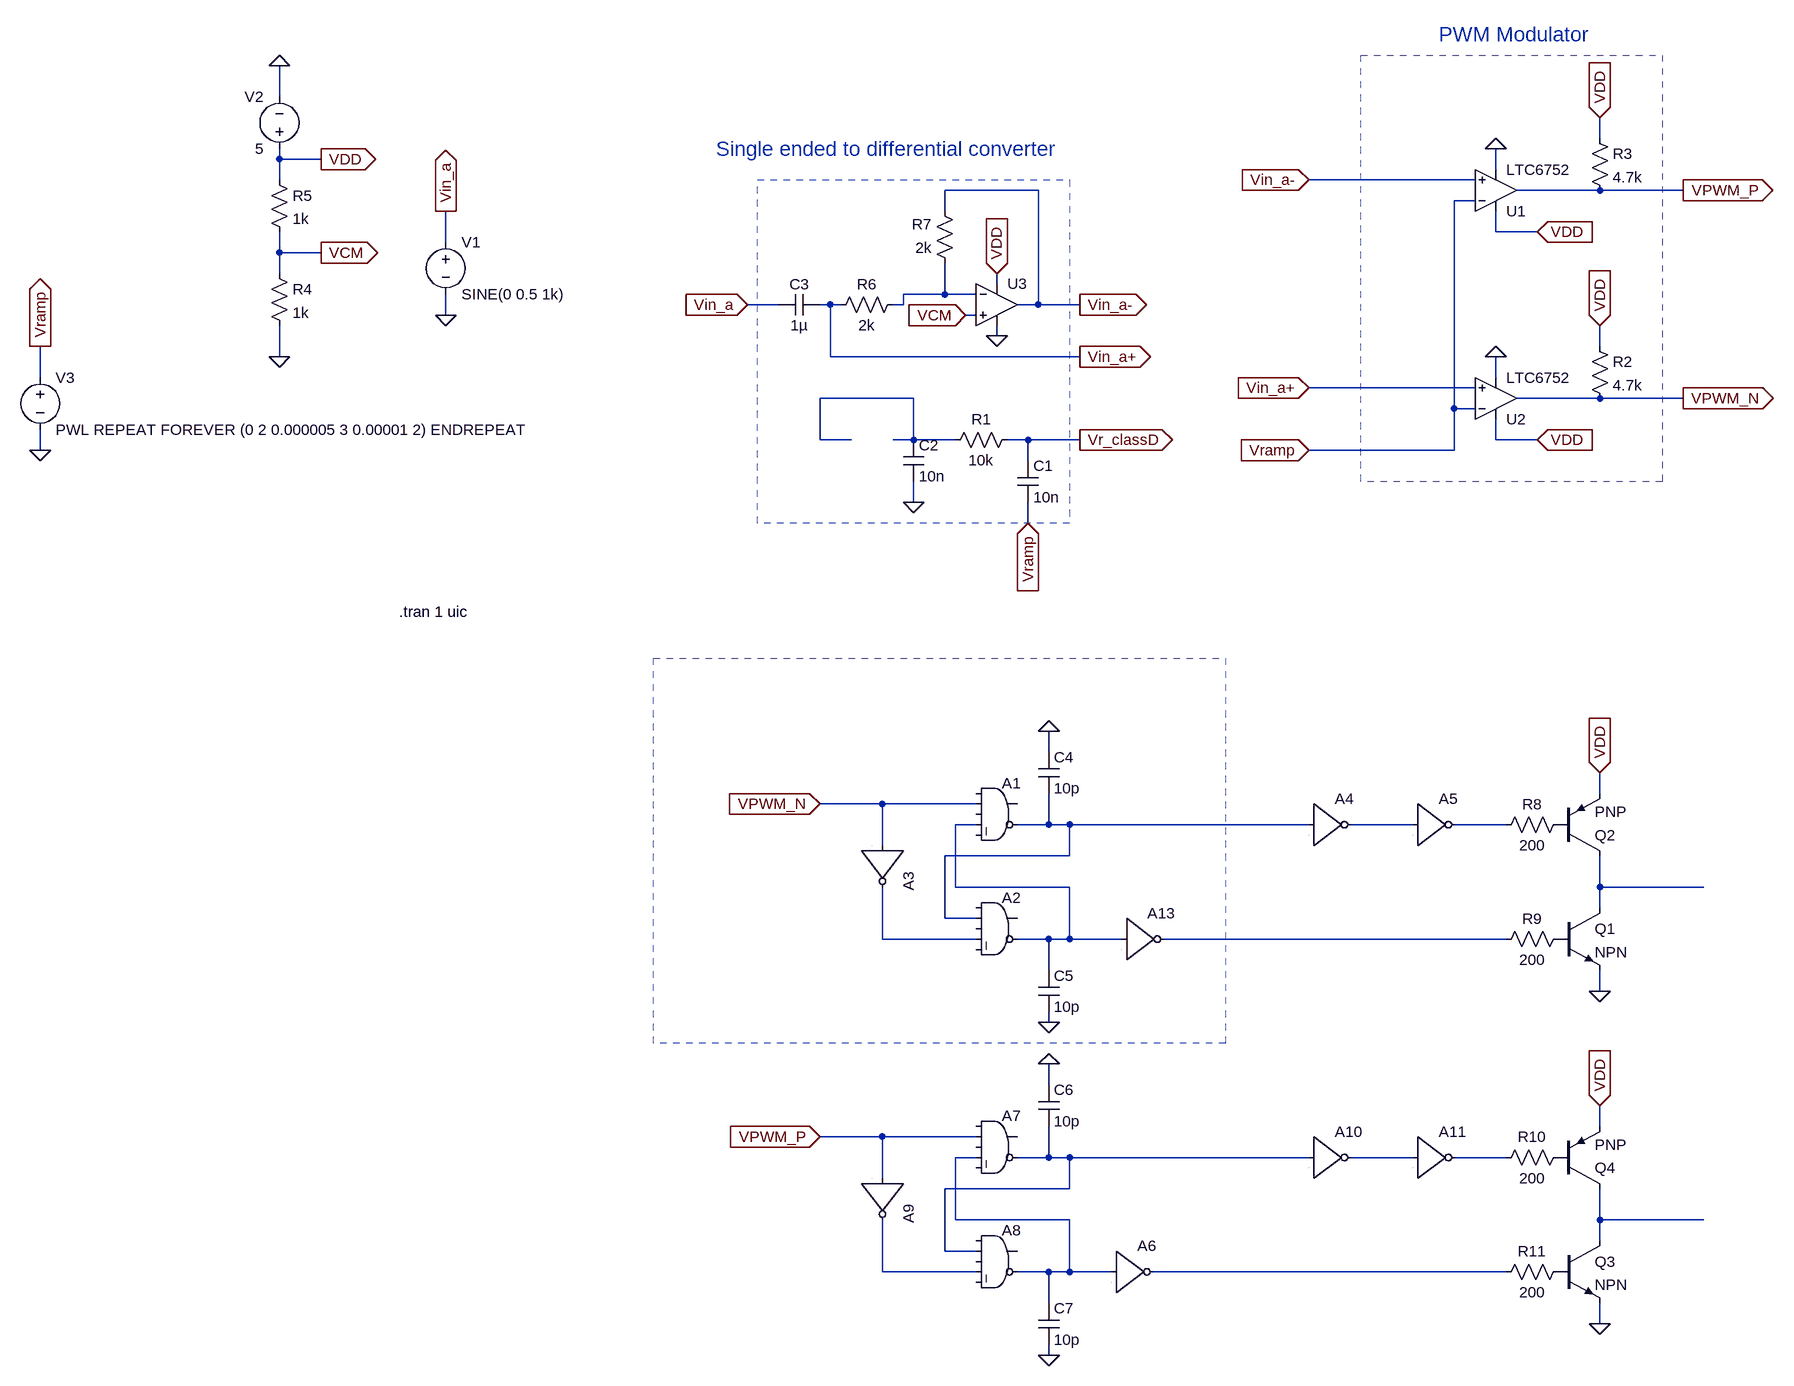
[diagram p0: schematic prelab5.asc]
prelab5.asc, the LTspice schematic file:
Version 4
SHEET 1 1432 1684
WIRE -896 -272 -896 -320
WIRE 1136 -208 1136 -240
WIRE -896 -176 -896 -192
WIRE -832 -176 -896 -176
WIRE 976 -160 976 -192
WIRE -896 -144 -896 -176
WIRE 944 -144 688 -144
WIRE 272 -128 128 -128
WIRE 1136 -128 1008 -128
WIRE 1264 -128 1136 -128
WIRE 944 -112 912 -112
WIRE 128 -96 128 -128
WIRE 976 -64 976 -96
WIRE 1040 -64 976 -64
WIRE -640 -48 -640 -96
WIRE -896 -32 -896 -64
WIRE -832 -32 -896 -32
WIRE -896 0 -896 -32
WIRE 208 16 208 0
WIRE 128 32 128 -16
WIRE 128 32 64 32
WIRE 176 32 128 32
WIRE -128 48 -176 48
WIRE -48 48 -64 48
WIRE -32 48 -48 48
WIRE 64 48 64 32
WIRE 64 48 48 48
WIRE 272 48 272 -128
WIRE 272 48 240 48
WIRE 336 48 272 48
WIRE -640 64 -640 32
WIRE 176 64 160 64
WIRE 208 96 208 80
WIRE 1136 112 1136 80
WIRE -896 128 -896 80
WIRE -48 128 -48 48
WIRE 336 128 -48 128
WIRE -1264 160 -1264 112
WIRE 976 160 976 128
WIRE 944 176 688 176
WIRE 80 192 -64 192
WIRE 1136 192 1008 192
WIRE 1264 192 1136 192
WIRE 912 208 912 -112
WIRE 944 208 912 208
WIRE -64 256 -64 192
WIRE -16 256 -64 256
WIRE 80 256 80 192
WIRE 80 256 48 256
WIRE 144 256 80 256
WIRE 256 256 224 256
WIRE 336 256 256 256
WIRE 976 256 976 224
WIRE 1040 256 976 256
WIRE -1264 272 -1264 240
WIRE 912 272 912 208
WIRE 912 272 688 272
WIRE 256 288 256 256
WIRE 80 352 80 320
WIRE 256 384 256 352
WIRE 288 736 288 704
WIRE 1136 800 1136 768
WIRE 32 816 -64 816
WIRE 176 816 32 816
WIRE 176 848 144 848
WIRE 288 848 288 800
WIRE 288 848 240 848
WIRE 320 848 288 848
WIRE 688 848 320 848
WIRE 848 848 752 848
WIRE 992 848 912 848
WIRE 32 880 32 816
WIRE 320 896 320 848
WIRE 320 896 128 896
WIRE 144 944 144 848
WIRE 320 944 144 944
WIRE 1136 944 1136 896
WIRE 1296 944 1136 944
WIRE 1136 976 1136 944
WIRE 128 992 128 896
WIRE 176 992 128 992
WIRE 32 1024 32 944
WIRE 176 1024 32 1024
WIRE 288 1024 240 1024
WIRE 320 1024 320 944
WIRE 320 1024 288 1024
WIRE 400 1024 320 1024
WIRE 992 1024 464 1024
WIRE 288 1072 288 1024
WIRE 1136 1104 1136 1072
WIRE 288 1152 288 1136
WIRE 288 1248 288 1216
WIRE 1136 1312 1136 1280
WIRE 32 1328 -64 1328
WIRE 176 1328 32 1328
WIRE 176 1360 144 1360
WIRE 288 1360 288 1312
WIRE 288 1360 240 1360
WIRE 320 1360 288 1360
WIRE 688 1360 320 1360
WIRE 848 1360 752 1360
WIRE 992 1360 912 1360
WIRE 32 1392 32 1328
WIRE 320 1408 320 1360
WIRE 320 1408 128 1408
WIRE 144 1456 144 1360
WIRE 320 1456 144 1456
WIRE 1136 1456 1136 1408
WIRE 1296 1456 1136 1456
WIRE 1136 1488 1136 1456
WIRE 128 1504 128 1408
WIRE 176 1504 128 1504
WIRE 32 1536 32 1456
WIRE 176 1536 32 1536
WIRE 288 1536 240 1536
WIRE 320 1536 320 1456
WIRE 320 1536 288 1536
WIRE 384 1536 320 1536
WIRE 992 1536 448 1536
WIRE 288 1584 288 1536
WIRE 1136 1616 1136 1584
WIRE 288 1664 288 1648
FLAG 336 48 Vin_a-
IOPIN 336 48 Out
FLAG 336 256 Vr_classD
IOPIN 336 256 Out
FLAG -176 48 Vin_a
IOPIN -176 48 In
FLAG 256 384 Vramp
IOPIN 256 384 In
FLAG -640 64 0
FLAG -640 -96 Vin_a
IOPIN -640 -96 Out
FLAG 1040 -64 VDD
IOPIN 1040 -64 In
FLAG 1040 256 VDD
IOPIN 1040 256 In
FLAG 976 128 0
FLAG 976 -192 0
FLAG 1136 -240 VDD
IOPIN 1136 -240 In
FLAG 1136 80 VDD
IOPIN 1136 80 In
FLAG 688 -144 Vin_a-
IOPIN 688 -144 In
FLAG 688 176 Vin_a+
IOPIN 688 176 In
FLAG 688 272 Vramp
IOPIN 688 272 In
FLAG 1264 -128 VPWM_P
IOPIN 1264 -128 Out
FLAG 1264 192 VPWM_N
IOPIN 1264 192 Out
FLAG -896 128 0
FLAG -896 -320 0
FLAG -832 -176 VDD
IOPIN -832 -176 Out
FLAG -832 -32 VCM
IOPIN -832 -32 Out
FLAG 208 0 VDD
IOPIN 208 0 In
FLAG 208 96 0
FLAG 160 64 VCM
IOPIN 160 64 In
FLAG -1264 112 Vramp
IOPIN -1264 112 Out
FLAG -1264 272 0
FLAG 80 352 0
FLAG 336 128 Vin_a+
IOPIN 336 128 Out
FLAG 288 1152 0
FLAG 288 704 0
FLAG -64 816 VPWM_N
IOPIN -64 816 In
FLAG 288 1664 0
FLAG 288 1216 0
FLAG -64 1328 VPWM_P
IOPIN -64 1328 In
FLAG 1136 1280 VDD
IOPIN 1136 1280 In
FLAG 1136 768 VDD
IOPIN 1136 768 In
FLAG 1136 1104 0
FLAG 1136 1616 0
SYMBOL res 240 240 R90
WINDOW 0 0 56 VBottom 2
WINDOW 3 32 56 VTop 2
SYMATTR InstName R1
SYMATTR Value 10k
SYMBOL cap 240 288 R0
SYMATTR InstName C1
SYMATTR Value 10n
SYMBOL cap 64 256 R0
SYMATTR InstName C2
SYMATTR Value 10n
SYMBOL voltage -640 -64 R0
WINDOW 123 0 0 Left 0
WINDOW 39 0 0 Left 0
SYMATTR InstName V1
SYMATTR Value SINE(0 0.5 1k)
SYMBOL Comparators\\LTC6752 976 -64 M180
SYMATTR InstName U1
SYMBOL Comparators\\LTC6752 976 256 M180
SYMATTR InstName U2
SYMBOL res 1120 96 R0
SYMATTR InstName R2
SYMATTR Value 4.7k
SYMBOL res 1120 -224 R0
SYMATTR InstName R3
SYMATTR Value 4.7k
SYMBOL res -912 -16 R0
SYMATTR InstName R4
SYMATTR Value 1k
SYMBOL res -912 -160 R0
SYMATTR InstName R5
SYMATTR Value 1k
SYMBOL voltage -896 -176 R180
WINDOW 0 24 96 Left 2
WINDOW 3 24 16 Left 2
WINDOW 123 0 0 Left 0
WINDOW 39 0 0 Left 0
SYMATTR InstName V2
SYMATTR Value 5
SYMBOL res 64 32 R90
WINDOW 0 0 56 VBottom 2
WINDOW 3 32 56 VTop 2
SYMATTR InstName R6
SYMATTR Value 2k
SYMBOL res 144 0 R180
WINDOW 0 36 76 Left 2
WINDOW 3 36 40 Left 2
SYMATTR InstName R7
SYMATTR Value 2k
SYMBOL cap -64 32 R90
WINDOW 0 0 32 VBottom 2
WINDOW 3 32 32 VTop 2
SYMATTR InstName C3
SYMATTR Value 1µ
SYMBOL OpAmps\\UniversalOpAmp1 208 48 R0
SYMATTR InstName U3
SYMBOL voltage -1264 144 R0
SYMATTR InstName V3
SYMATTR Value PWL REPEAT FOREVER (0 2 0.000005 3 0.00001 2) ENDREPEAT
SYMBOL Digital\\and 208 768 R0
SYMATTR InstName A1
SYMATTR SpiceLine Vhigh=5 Vlow=0 ref=2.5
SYMBOL Digital\\and 208 944 R0
SYMATTR InstName A2
SYMATTR SpiceLine Vhigh=5 Vlow=0 ref=2.5
SYMBOL Digital\\inv 96 880 R90
SYMATTR InstName A3
SYMATTR SpiceLine Vhigh=5 Vlow=0 ref=2.5
SYMBOL cap 272 736 R0
SYMATTR InstName C4
SYMATTR Value 10p
SYMBOL cap 272 1072 R0
SYMATTR InstName C5
SYMATTR Value 10p
SYMBOL Digital\\inv 688 784 R0
SYMATTR InstName A4
SYMATTR SpiceLine Vhigh=5 Vlow=0 ref=2.5
SYMBOL Digital\\inv 848 784 R0
SYMATTR InstName A5
SYMATTR SpiceLine Vhigh=5 Vlow=0 ref=2.5
SYMBOL res 1088 832 R90
WINDOW 0 0 56 VBottom 2
WINDOW 3 32 56 VTop 2
SYMATTR InstName R8
SYMATTR Value 200
SYMBOL res 1088 1008 R90
WINDOW 0 0 56 VBottom 2
WINDOW 3 32 56 VTop 2
SYMATTR InstName R9
SYMATTR Value 200
SYMBOL npn 1072 976 R0
SYMATTR InstName Q1
SYMBOL pnp 1072 896 M180
SYMATTR InstName Q2
SYMBOL Digital\\and 208 1280 R0
SYMATTR InstName A7
SYMATTR SpiceLine Vhigh=5 Vlow=0 ref=2.5
SYMBOL Digital\\and 208 1456 R0
SYMATTR InstName A8
SYMATTR SpiceLine Vhigh=5 Vlow=0 ref=2.5
SYMBOL Digital\\inv 96 1392 R90
SYMATTR InstName A9
SYMATTR SpiceLine Vhigh=5 Vlow=0 ref=2.5
SYMBOL cap 272 1248 R0
SYMATTR InstName C6
SYMATTR Value 10p
SYMBOL cap 272 1584 R0
SYMATTR InstName C7
SYMATTR Value 10p
SYMBOL Digital\\inv 688 1296 R0
SYMATTR InstName A10
SYMATTR SpiceLine Vhigh=5 Vlow=0 ref=2.5
SYMBOL Digital\\inv 848 1296 R0
SYMATTR InstName A11
SYMATTR SpiceLine Vhigh=5 Vlow=0 ref=2.5
SYMBOL res 1088 1344 R90
WINDOW 0 0 56 VBottom 2
WINDOW 3 32 56 VTop 2
SYMATTR InstName R10
SYMATTR Value 200
SYMBOL res 1088 1520 R90
WINDOW 0 0 56 VBottom 2
WINDOW 3 32 56 VTop 2
SYMATTR InstName R11
SYMATTR Value 200
SYMBOL npn 1072 1488 R0
SYMATTR InstName Q3
SYMBOL pnp 1072 1408 M180
SYMATTR InstName Q4
SYMBOL Digital\\inv 400 960 R0
SYMATTR InstName A13
SYMATTR SpiceLine Vhigh=5 Vlow=0 ref=2.5
SYMBOL Digital\\inv 384 1472 R0
SYMATTR InstName A6
SYMATTR SpiceLine Vhigh=5 Vlow=0 ref=2.5
TEXT -712 520 Left 2 !.tran 1 uic
TEXT -224 -192 Left 3 ;Single ended to differential converter
TEXT 888 -368 Left 3 ;PWM Modulator
RECTANGLE Normal 1232 320 768 -336 2
RECTANGLE Normal 320 384 -160 -144 2
RECTANGLE Normal 560 1184 -320 592 2

The netlist it stands for:
* prelab5.asc
R1 Vr_classD N002 10k
C1 Vr_classD Vramp 10n
C2 N002 0 10n
V1 Vin_a 0 SINE(0 0.5 1k)
XU1 Vin_a- Vramp VDD 0 VPWM_P LTC6752  ; pins In+ In- V+ V- OUT
XU2 Vin_a+ Vramp VDD 0 VPWM_N LTC6752  ; pins In+ In- V+ V- OUT
R2 VDD VPWM_N 4.7k
R3 VDD VPWM_P 4.7k
R4 VCM 0 1k
R5 VDD VCM 1k
V2 VDD 0 5
R6 N001 Vin_a+ 2k
R7 N001 Vin_a- 2k
C3 Vin_a+ Vin_a 1µ
XU3 VCM N001 VDD 0 Vin_a- level1 Avol=1Meg GBW=10Meg Vos=0 En=0 Enk=0 In=0 Ink=0 Rin=500Meg  ; pins In+ In- V+ V- OUT
V3 Vramp 0 PWL REPEAT FOREVER (0 2 0.000005 3 0.00001 2) ENDREPEAT
A1 0 VPWM_N 0 N003 0 N004 0 0 AND Vhigh=5 Vlow=0 ref=2.5
A2 0 N004 0 N008 0 N003 0 0 AND Vhigh=5 Vlow=0 ref=2.5
A3 VPWM_N 0 0 0 0 N008 0 0 BUF Vhigh=5 Vlow=0 ref=2.5
C4 0 N004 10p
C5 N003 0 10p
A4 N004 0 0 0 0 N005 0 0 BUF Vhigh=5 Vlow=0 ref=2.5
A5 N005 0 0 0 0 N006 0 0 BUF Vhigh=5 Vlow=0 ref=2.5
R8 P001 N006 200
R9 P002 N009 200
Q1 N007 P002 0 0 NPN
Q2 N007 P001 VDD 0 PNP
A7 0 VPWM_P 0 N010 0 N011 0 0 AND Vhigh=5 Vlow=0 ref=2.5
A8 0 N011 0 N015 0 N010 0 0 AND Vhigh=5 Vlow=0 ref=2.5
A9 VPWM_P 0 0 0 0 N015 0 0 BUF Vhigh=5 Vlow=0 ref=2.5
C6 0 N011 10p
C7 N010 0 10p
A10 N011 0 0 0 0 N012 0 0 BUF Vhigh=5 Vlow=0 ref=2.5
A11 N012 0 0 0 0 N013 0 0 BUF Vhigh=5 Vlow=0 ref=2.5
R10 P003 N013 200
R11 P004 N016 200
Q3 N014 P004 0 0 NPN
Q4 N014 P003 VDD 0 PNP
A13 N003 0 0 0 0 N009 0 0 BUF Vhigh=5 Vlow=0 ref=2.5
A6 N010 0 0 0 0 N016 0 0 BUF Vhigh=5 Vlow=0 ref=2.5
.model NPN NPN
.model PNP PNP
.lib standard.bjt
.tran 1 uic
* Single ended to differential converter
* PWM Modulator
.lib LTC7.lib
.lib UniversalOpAmp1.lib
.backanno
.end